# Altium schematic sheet 2312_Microcontroleur.SchDoc
size A4; Organization: ETML-ES; Address1: Avenue Recordon 1; Address2: 1004 Lausanne; Address3: Switzerland; SheetNumber: 3; SheetTotal: 6
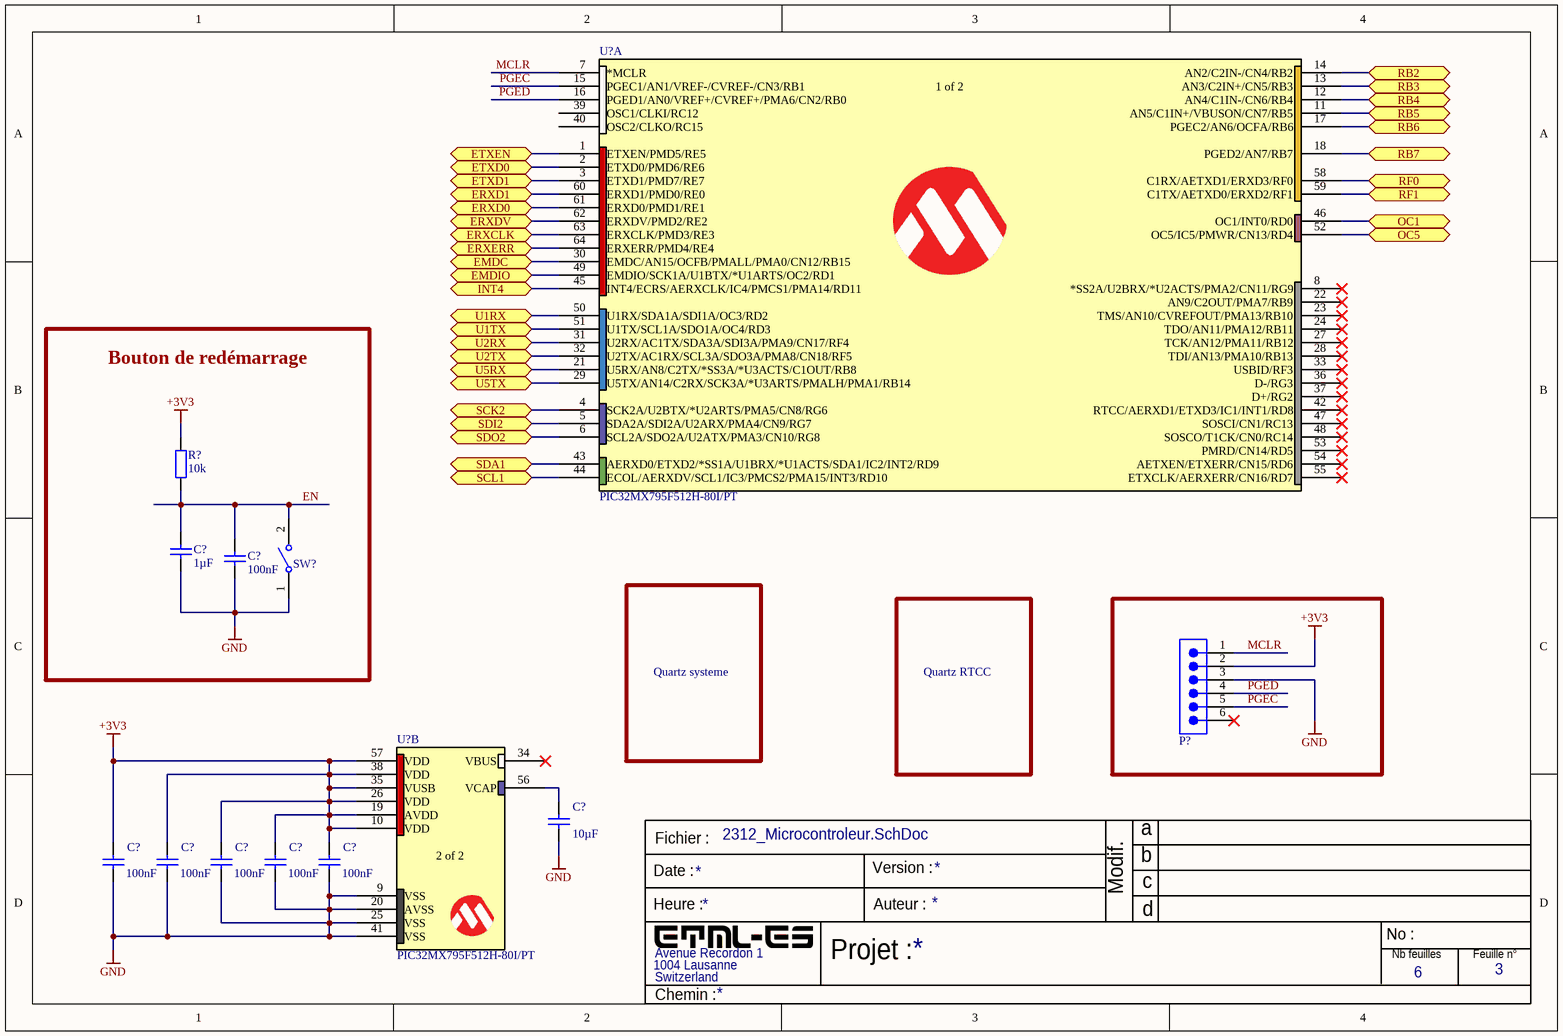
[diagram p0: 2312_Microcontroleur.SchDoc]

## Parts
(Parts that share a designator on the sheet are numbered #1, #2 ... from top to bottom, then left to right.)
C?#1  100nF  [WCAP-CSGP_0805_L2W1.25H0.8_Reflow]
C?#2  1µF  [WCAP-CSGP_0805_L2W1.25H1.25]
C?#3  10µF  [WCAP-CSGP_0805_L2W1.25H1.25]
C?#4  100nF  [WCAP-CSGP_0805_L2W1.25H0.8_Reflow]
C?#5  100nF  [WCAP-CSGP_0805_L2W1.25H0.8_Reflow]
C?#6  100nF  [WCAP-CSGP_0805_L2W1.25H0.8_Reflow]
C?#7  100nF  [WCAP-CSGP_0805_L2W1.25H0.8_Reflow]
C?#8  100nF  [WCAP-CSGP_0805_L2W1.25H0.8_Reflow]
P?  61300611121  [61300611121]  (value not drawn)
R?  Resistance: 10k  [2312-RES-0805]  (hidden comment: RES-0805)
SW?  434121050836  [WS-TASV_L6W3.5H5_4341x10508x6]  (value not drawn)
U?#1  PIC32MX795F512H-80I/PT  [TQFP64_10x10MC_MCH]  (part A of 2)
U?#2  PIC32MX795F512H-80I/PT  [TQFP64_10x10MC_MCH]  (part B of 2)

## Blocks framed on the sheet
Bouton de redémarrage: C?#1 C?#2 R? SW?

## Ports
EMDC (bidir), EMDIO (bidir), ERXCLK (bidir), ERXD0 (bidir), ERXD1 (bidir), ERXDV (bidir), ERXERR (bidir), ETXD0 (bidir), ETXD1 (bidir), ETXEN (bidir), INT4 (bidir), OC1 (bidir), OC5 (bidir), RB2 (bidir), RB3 (bidir), RB4 (bidir), RB5 (bidir), RB6 (bidir), RB7 (bidir), RF0 (bidir), RF1 (bidir), SCK2 (bidir), SCL1 (bidir), SDA1 (bidir), SDI2 (bidir), SDO2 (bidir), U1RX (bidir), U1TX (bidir), U2RX (bidir), U2TX (bidir), U5RX (bidir), U5TX (bidir)

## Nets
+3V3: C?#4.2 C?#5.2 C?#6.2 C?#7.2 C?#8.2 P?.2 R?.0 U?#2.10(VDD) U?#2.19(AVDD) U?#2.26(VDD) U?#2.35(VUSB) U?#2.38(VDD) U?#2.57(VDD)
GND: C?#1.2 C?#2.1 C?#3.1 C?#4.1 C?#5.1 C?#6.1 C?#7.1 C?#8.1 P?.3 SW?.1 U?#2.9(VSS) U?#2.20(AVSS) U?#2.25(VSS) U?#2.41(VSS)
EMDC: U?#1.30(EMDC/AN15/OCFB/PMALL/PMA0/CN12/RB15) ; port EMDC
EMDIO: U?#1.49(EMDIO/SCK1A/U1BTX/*U1ARTS/OC2/RD1) ; port EMDIO
EN: C?#1.1 C?#2.2 R?.1 SW?.2
ERXCLK: U?#1.63(ERXCLK/PMD3/RE3) ; port ERXCLK
ERXD0: U?#1.61(ERXD0/PMD1/RE1) ; port ERXD0
ERXD1: U?#1.60(ERXD1/PMD0/RE0) ; port ERXD1
ERXDV: U?#1.62(ERXDV/PMD2/RE2) ; port ERXDV
ERXERR: U?#1.64(ERXERR/PMD4/RE4) ; port ERXERR
ETXD0: U?#1.2(ETXD0/PMD6/RE6) ; port ETXD0
ETXD1: U?#1.3(ETXD1/PMD7/RE7) ; port ETXD1
ETXEN: U?#1.1(ETXEN/PMD5/RE5) ; port ETXEN
INT4: U?#1.45(INT4/ECRS/AERXCLK/IC4/PMCS1/PMA14/RD11) ; port INT4
MCLR: P?.1 U?#1.7(*MCLR)
OC1: U?#1.46(OC1/INT0/RD0) ; port OC1
OC5: U?#1.52(OC5/IC5/PMWR/CN13/RD4) ; port OC5
PGEC: P?.5 U?#1.15(PGEC1/AN1/VREF-/CVREF-/CN3/RB1)
PGED: P?.4 U?#1.16(PGED1/AN0/VREF+/CVREF+/PMA6/CN2/RB0)
RB2: U?#1.14(AN2/C2IN-/CN4/RB2) ; port RB2
RB3: U?#1.13(AN3/C2IN+/CN5/RB3) ; port RB3
RB4: U?#1.12(AN4/C1IN-/CN6/RB4) ; port RB4
RB5: U?#1.11(AN5/C1IN+/VBUSON/CN7/RB5) ; port RB5
RB6: U?#1.17(PGEC2/AN6/OCFA/RB6) ; port RB6
RB7: U?#1.18(PGED2/AN7/RB7) ; port RB7
RF0: U?#1.58(C1RX/AETXD1/ERXD3/RF0) ; port RF0
RF1: U?#1.59(C1TX/AETXD0/ERXD2/RF1) ; port RF1
SCK2: U?#1.4(SCK2A/U2BTX/*U2ARTS/PMA5/CN8/RG6) ; port SCK2
SCL1: U?#1.44(ECOL/AERXDV/SCL1/IC3/PMCS2/PMA15/INT3/RD10) ; port SCL1
SDA1: U?#1.43(AERXD0/ETXD2/*SS1A/U1BRX/*U1ACTS/SDA1/IC2/INT2/RD9) ; port SDA1
SDI2: U?#1.5(SDA2A/SDI2A/U2ARX/PMA4/CN9/RG7) ; port SDI2
SDO2: U?#1.6(SCL2A/SDO2A/U2ATX/PMA3/CN10/RG8) ; port SDO2
U1RX: U?#1.50(U1RX/SDA1A/SDI1A/OC3/RD2) ; port U1RX
U1TX: U?#1.51(U1TX/SCL1A/SDO1A/OC4/RD3) ; port U1TX
U2RX: U?#1.31(U2RX/AC1TX/SDA3A/SDI3A/PMA9/CN17/RF4) ; port U2RX
U2TX: U?#1.32(U2TX/AC1RX/SCL3A/SDO3A/PMA8/CN18/RF5) ; port U2TX
U5RX: U?#1.21(U5RX/AN8/C2TX/*SS3A/*U3ACTS/C1OUT/RB8) ; port U5RX
U5TX: U?#1.29(U5TX/AN14/C2RX/SCK3A/*U3ARTS/PMALH/PMA1/RB14) ; port U5TX
NetC?#3_2: C?#3.2 U?#2.56(VCAP)

Not connected (* = marked no-connect by the designer): P? 6*; U?#1 8(*SS2A/U2BRX/*U2ACTS/PMA2/CN11/RG9)* 22(AN9/C2OUT/PMA7/RB9)* 23(TMS/AN10/CVREFOUT/PMA13/RB10)* 24(TDO/AN11/PMA12/RB11)* 27(TCK/AN12/PMA11/RB12)* 28(TDI/AN13/PMA10/RB13)* 33(USBID/RF3)* 36(D-/RG3)* 37(D+/RG2)* 39(OSC1/CLKI/RC12) 40(OSC2/CLKO/RC15) 42(RTCC/AERXD1/ETXD3/IC1/INT1/RD8)* 47(SOSCI/CN1/RC13)* 48(SOSCO/T1CK/CN0/RC14)* 53(PMRD/CN14/RD5)* 54(AETXEN/ETXERR/CN15/RD6)* 55(ETXCLK/AERXERR/CN16/RD7)*; U?#2 34(VBUS)*

## Notes on the sheet
- Quartz systeme
- Quartz RTCC
- Fichier :
- a
- Date :
- Heure :
- Version :
- Auteur :
- Modif.
- b
- c
- d
- Projet :
- No :
- Nb feuilles
- Feuille n°
- Chemin :
- (in symbol PIC32MX795F512H-80I/PT, part A) 1 of 2
- (in symbol PIC32MX795F512H-80I/PT, part B) 2 of 2

## Library data of the parts
C?#1 C?#4-C?#8 = 885012207016: WCAP-CSGP Multilayer Ceramic Chip Capacitor, General Purpose, size 0805, X7R, 100nF, 10VDC; Manufacturer: Wurth Elektronik; Case/Size Code: 0805; Capacitance Tolerance: +/-10%; Dissipation Factor: 5%; Insulation Resistance: 5GΩ; Rated Voltage (DC): 10V; Technical Reference: X7R0805104K010DFCT10000; Manufacturer Part Number: 885012207016; Category: Multilayer Ceramic Chip Capacitors; Match Code: WCAP-CSGP; ComponentLink1Description: Website Link; ComponentLink1URL: https://www.we-online.com/redexpert/article/885012207016?ad; ComponentLink2Description: Datasheet Link; ComponentLink2URL: https://www.we-online.com/redexpert/spec/885012207016?ad; Mount: Surface Mount; Operating Temperature Max: 125°C; Operating Temperature Min: -55°C; Packaging: Tape and Reel; Length: 2mm; Width: 1.25mm; Height: 0.8mm; Capacitance: 100nF; Ceramic Type: X7R
C?#2 = 885012207022: WCAP-CSGP Multilayer Ceramic Chip Capacitor, General Purpose, size 0805, X7R, 1µF, 10VDC; Manufacturer: Wurth Elektronik; Case/Size Code: 0805; Capacitance Tolerance: +/-10%; Dissipation Factor: 5%; Insulation Resistance: 0.5GΩ; Rated Voltage (DC): 10V; Technical Reference: X7R0805105K010DFCT10000; Manufacturer Part Number: 885012207022; Category: Multilayer Ceramic Chip Capacitors; Match Code: WCAP-CSGP; ComponentLink1Description: Website Link; ComponentLink1URL: https://www.we-online.com/redexpert/article/885012207022?ad; ComponentLink2Description: Datasheet Link; ComponentLink2URL: https://www.we-online.com/redexpert/spec/885012207022?ad; Mount: Surface Mount; Operating Temperature Max: 125°C; Operating Temperature Min: -55°C; Packaging: Tape and Reel; Length: 2mm; Width: 1.25mm; Height: 1.25mm; Capacitance: 1µF; Ceramic Type: X7R
C?#3 = 885012207003: WCAP-CSGP Multilayer Ceramic Chip Capacitor, General Purpose, size 0805, X7R, 10µF, 6.3VDC; Manufacturer: Wurth Elektronik; Case/Size Code: 0805; Capacitance Tolerance: +/-10%; Dissipation Factor: 10%; Insulation Resistance: 0.01GΩ; Rated Voltage (DC): 6.3V; Technical Reference: X7R0805106K6R3DFCT10000; Manufacturer Part Number: 885012207003; Category: Multilayer Ceramic Chip Capacitors; Match Code: WCAP-CSGP; ComponentLink1Description: Website Link; ComponentLink1URL: https://www.we-online.com/redexpert/article/885012207003?ad; ComponentLink2Description: Datasheet Link; ComponentLink2URL: https://www.we-online.com/redexpert/spec/885012207003?ad; Mount: Surface Mount; Operating Temperature Max: 125°C; Operating Temperature Min: -55°C; Packaging: Tape and Reel; Length: 2mm; Width: 1.25mm; Height: 1.25mm; Capacitance: 10µF; Ceramic Type: X7R
P? = 61300611121: WR-PHD Pin Header, THT, Vertical, pitch 2.54mm, 1 Row, 6P; Manufacturer: Wurth Elektronik; Contact Resistance: 20mΩ; Rated Current: 3A; Working Voltage: 250V; Withstanding Voltage: 500V; ComponentLink1Description: Website Link; ComponentLink1URL: https://www.we-online.com/redexpert/article/61300611121?ad; ComponentLink2Description: Datasheet Link; ComponentLink2URL: https://www.we-online.com/redexpert/spec/61300611121?ad; Manufacturer Part Number: 61300611121; Category: Board-to-Board Connectors; Match Code: WR-PHD; Mount: Through Hole; Operating Temperature Max: 105°C; Operating Temperature Min: -40°C; Packaging: Bag; Gender: Pin Header; Number of Pins: 6; Number of Rows: 1; Orientation: Vertical; Pitch: 2.54mm
SW? = 434121050836: WS-TASV SMT Tact Switch, L6 x W3.5 x H5mm, 360g, SPST-NO, 12V, 50mA; Manufacturer: Wurth Elektronik; Washable: No; Manufacturer Part Number: 434121050836; Category: Tact Switches; Match Code: WS-TASV; ComponentLink1Description: Website Link; ComponentLink1URL: https://www.we-online.com/redexpert/article/434121050836?ad; ComponentLink2Description: Datasheet Link; ComponentLink2URL: https://www.we-online.com/redexpert/spec/434121050836?ad; Mount: Surface Mount; Operating Temperature Max: 85°C; Operating Temperature Min: -40°C; Packaging: Tape and Reel; Length: 6mm; Width: 3.5mm; Height: 5mm; Circuit: SPST-NO; Contact Material: Stainless Steel; Contact Plating: Silver; Operation Force: 360g; Rated Current: 50mA; Rated Voltage (DC): 12V; Terminal Material: Copper Alloy; Terminal Plating: Silver
U?#1 U?#2 = PIC32MX795F512H-80I/PT: No Description Available; Mfr_Name: Microchip; RefDes: RefDes; Type: Type